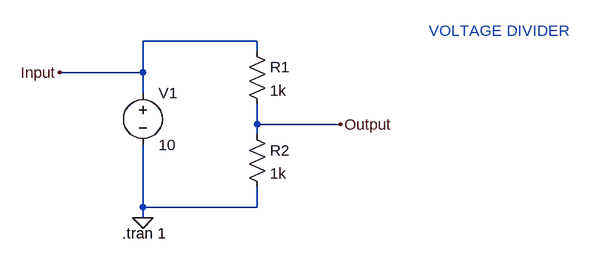
[diagram p0: schematic Voltage Divider.asc]
Voltage Divider.asc, the LTspice schematic file:
Version 4
SHEET 1 880 680
WIRE 224 32 48 32
WIRE 224 48 224 32
WIRE 48 80 48 32
WIRE 48 80 -80 80
WIRE 48 112 48 80
WIRE 224 160 224 128
WIRE 352 160 224 160
WIRE 224 176 224 160
WIRE 48 288 48 192
WIRE 224 288 224 256
WIRE 224 288 48 288
WIRE 48 304 48 288
FLAG 48 304 0
FLAG 352 160 Output
FLAG -80 80 Input
SYMBOL res 208 160 R0
SYMATTR InstName R2
SYMATTR Value 1k
SYMBOL voltage 48 96 R0
WINDOW 123 0 0 Left 0
WINDOW 39 0 0 Left 0
SYMATTR InstName V1
SYMATTR Value 10
SYMBOL res 208 32 R0
SYMATTR InstName R1
SYMATTR Value 1k
TEXT 16 328 Left 2 !.tran 1
TEXT 488 16 Left 2 ;VOLTAGE DIVIDER

The netlist it stands for:
* Voltage Divider.asc
R2 Output 0 1k
V1 Input 0 10
R1 Input Output 1k
.tran 1
* VOLTAGE DIVIDER
.backanno
.end